# EAGLE schematic pirmod (EAGLE 7.2.0)
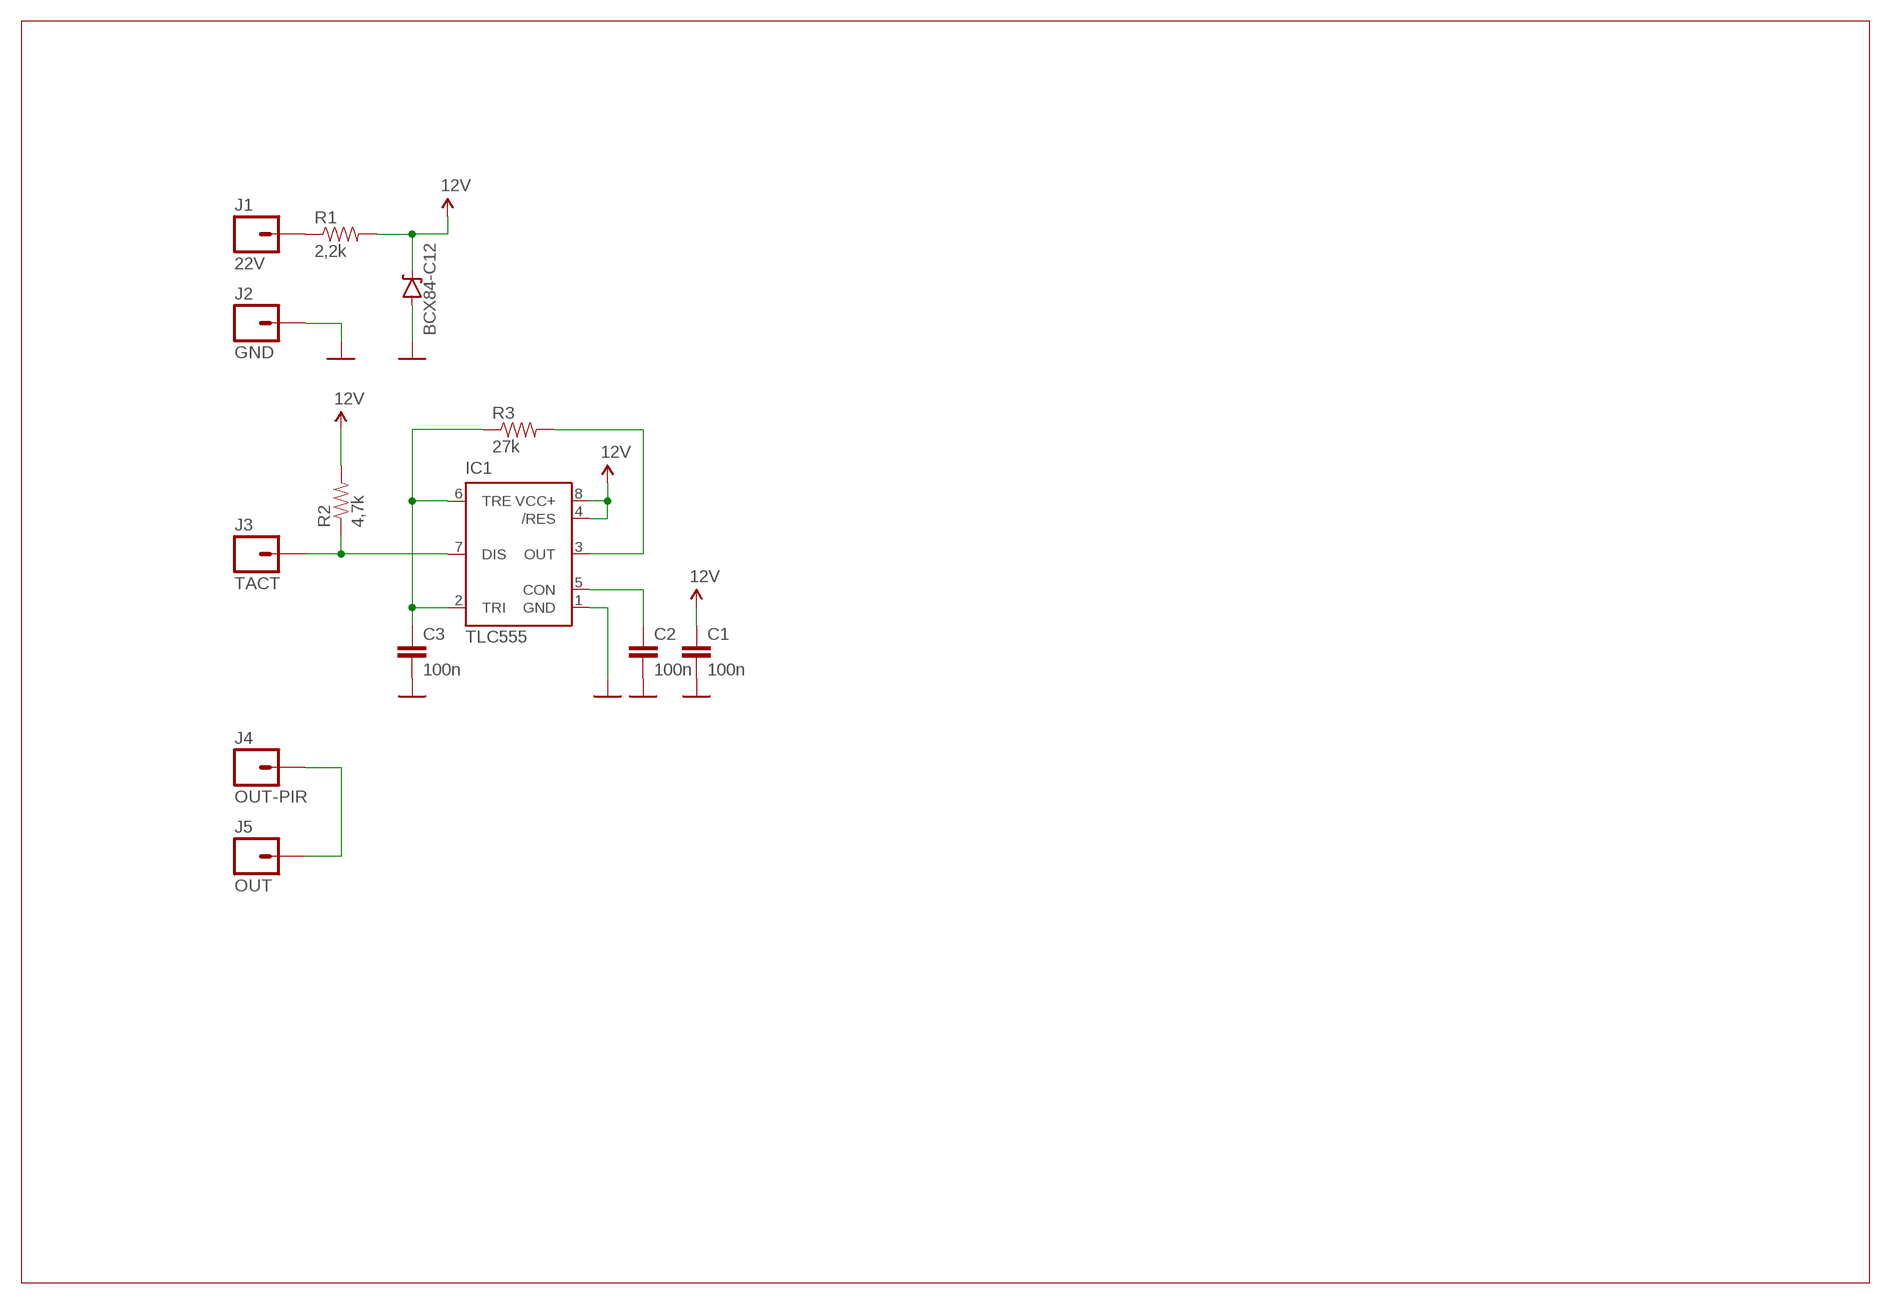
[diagram p0: schematic, sheet 1]

## Parts
C1  100n  CAP0805  [0805]
C2  100n  CAP0805  [0805]
C3  100n  CAP0805  [0805]
D1  BCX84-C12  DIODE-ZENER12V  [SOT23-3]
IC1  TLC555  NE555D  [SO08]
J1  22V  M01PTH  [1X01]
J2  GND  M01SMD-4.5X1.5  [PAD-1.5X4.5]
J3  TACT  M01PTH  [1X01]
J4  OUT-PIR  M01PTH  [1X01]
J5  OUT  M01PTH  [1X01]
R1  2,2k  RESISTOR0805-RES  [0805]
R2  4,7k  RESISTOR0805-RES  [0805]
R3  27k  RESISTOR0805-RES  [0805]

## Nets
12V: C1.1 D1.3(C) IC1.4(/RES) IC1.8(VCC+) R1.2 R2.2
GND: C1.2 C2.2 C3.2 D1.1(A) IC1.1(GND) J2.P$1
N$1: J4.1 J5.1
N$3: C3.1 IC1.2(TRI) IC1.6(TRE) R3.1
N$5: J1.1 R1.1
N$7: C2.1 IC1.5(CON)
N$8: IC1.3(OUT) R3.2
N$9: IC1.7(DIS) J3.1 R2.1

## Library data of the parts
C1-C3 = SparkFun-Capacitors:CAP: Capacitor Standard 0603 ceramic capacitor, and 0.1" leaded capacitor.
D1 = SparkFun-DiscreteSemi:DIODE-ZENER: Zener Diode Production Part - 8199 3.4V Zener Voltage
IC1 = SparkFun-AnalogIC:NE555: General purpose bipolar Timer
J1-J5 = SparkFun-Connectors:M01: Header 1 Standard 1-pin 0.1" header. Use with straight break away headers (SKU : PRT-00116), right angle break away headers (PRT-00553), swiss pins (PRT-00743), machine pins (PRT-00117), and female headers (PRT-00115).
R1-R3 = SparkFun-Passives:RESISTOR: Resistor Basic schematic elements and footprints for 0603, 1206, and PTH resistors.